# Altium project Led Cape.PrjPCB
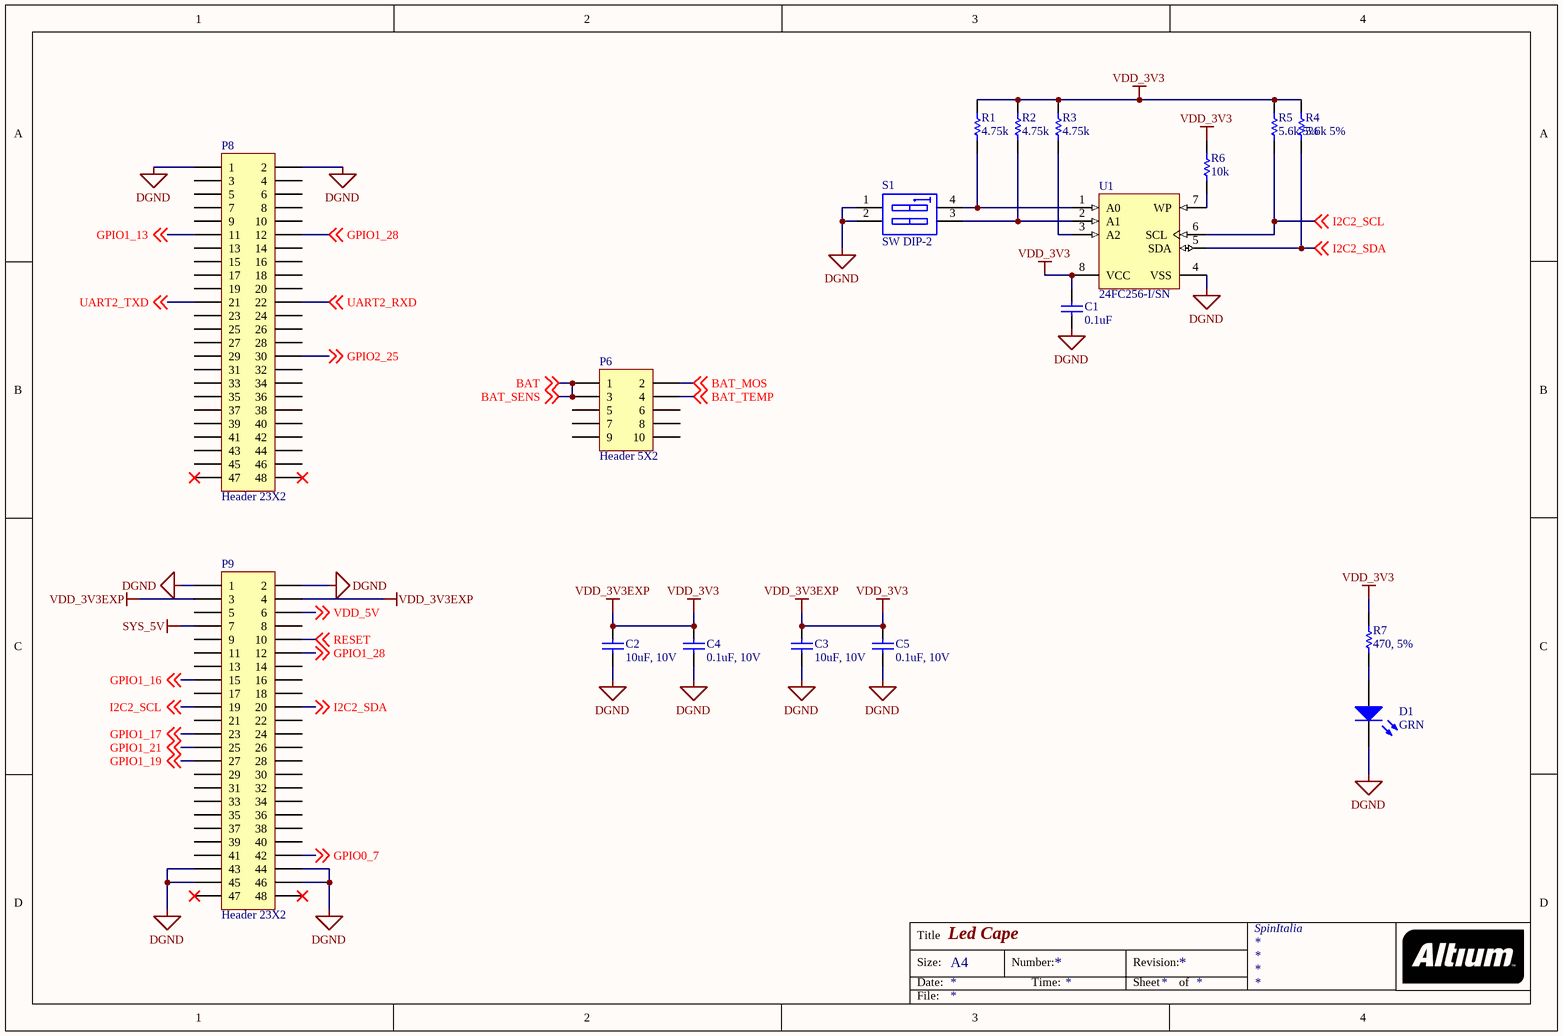
[diagram p0: Led Cape.SchDoc]
5 sheets, 52 parts. Net scope: global (net labels, ports and power ports of the same name join across sheets).
Sheets:
  Led Cape.SchDoc
  Beaglebone Led Cape.SchDoc
  battery cape.SchDoc
  Gps cape.SchDoc
  Relè Cape.SchDoc

## Sheet Led Cape.SchDoc: Led Cape
size A4; Author: Luca Lucci; CompanyName: SpinItalia; Engineer: Luca Lucci; Organization: SpinItalia; ProjectName: Led Cape

### Parts
(Parts that share a designator on the sheet are numbered #1, #2 ... from top to bottom, then left to right.)
C1  0.1uF  [1608[0603]]
C2  10uF, 10V  [1608[0603]]
C3  10uF, 10V  [1608[0603]]
C4  0.1uF, 10V  [1608[0603]]
C5  0.1uF, 10V  [1608[0603]]
D1#1  GRN  [3.5X2.8X1.9]
P6  Header 5X2  [HDR2X5]
P8  Header 23X2  [HDR2X24]
P9  Header 23X2  [HDR2X24]
R1  4.75k  [6-0805_N]
R2  4.75k  [6-0805_N]
R3  4.75k  [6-0805_N]
R4  5.6k 5%  [6-0805_N]
R5  5.6k 5%  [6-0805_N]
R6  10k  [6-0805_N]
R7  470, 5%  [6-0805_N]
S1  SW DIP-2  [DIP-4]
U1#1  24FC256-I/SN  [SOIC-SN8_N]

### Nets
DGND: C1.1 C2.1 C3.1 C4.1 C5.1 D1#1.2(K) P8.1 P8.2 P9.1 P9.2 P9.43 P9.44 P9.45 P9.46 S1.1(A1) S1.2(A2) U1#1.4(VSS)
SYS_5V: P9.7
VDD_3V3: C1.2 C2.2 C3.2 C4.2 C5.2 P9.3 P9.4 R1.1 R2.1 R3.1 R4.2 R5.2 R6.2 R7.2 U1#1.8(VCC)  [also labelled VDD_3V3EXP]
BAT: P6.1 P6.3 ; off-sheet BAT_SENS, off-sheet BAT  [also labelled BAT_SENS]
BAT_MOS: P6.2 ; off-sheet BAT_MOS
BAT_TEMP: P6.4 ; off-sheet BAT_TEMP
GPIO0_7: P9.42 ; off-sheet GPIO0_7
GPIO1_13: P8.11 ; off-sheet GPIO1_13
GPIO1_16: P9.15 ; off-sheet GPIO1_16
GPIO1_17: P9.23 ; off-sheet GPIO1_17
GPIO1_19: P9.27 ; off-sheet GPIO1_19
GPIO1_21: P9.25 ; off-sheet GPIO1_21
GPIO1_28: P8.12 P9.12 ; off-sheet GPIO1_28
GPIO2_25: P8.30 ; off-sheet GPIO2_25
I2C2_SCL: P9.19 R5.1 U1#1.6(SCL) ; off-sheet I2C2_SCL
I2C2_SDA: P9.20 R4.1 U1#1.5(SDA) ; off-sheet I2C2_SDA
RESET: P9.10 ; off-sheet RESET
UART2_RXD: P8.22 ; off-sheet UART2_RXD
UART2_TXD: P8.21 ; off-sheet UART2_TXD
VDD_5V: P9.6 ; off-sheet VDD_5V
NetD1#1_1: D1#1.1(A) R7.1
NetR1_2: R1.2 S1.4(B1) U1#1.1(A0)
NetR2_2: R2.2 S1.3(B2) U1#1.2(A1)
NetR3_2: R3.2 U1#1.3(A2)
NetR6_1: R6.1 U1#1.7(WP)

Not connected (* = marked no-connect by the designer): P6 5 6 7 8 9 10; P8 3 4 5 6 7 8 9 10 13 14 15 16 17 18 19 20 23 24 25 26 27 28 29 31 32 33 34 35 36 37 38 39 40 41 42 43 44 45 46 47* 48*; P9 5 8 9 11 13 14 16 17 18 21 22 24 26 28 29 30 31 32 33 34 35 36 37 38 39 40 41 47* 48*

### Notes on the sheet
- Title
- Size:
- Date:
- A4
- Number:
- Time:
- Revision:
- Sheet
- of
- File:

### Library data of the parts
C1-C5 = Cap: Capacitor; Value: 100pF; Published: 8-Jun-2000; LatestRevisionDate: 17-Jul-2002; LatestRevisionNote: Re-released for DXP Platform.; PackageReference: RAD-0.3; Publisher: Altium Limited; PackageDescription: Radial Cap, Thru-Hole; 2 Leads; 0.3 in Pin Spacing
D1#1 = LED3: Typical BLUE SiC LED; Published: 8-Jun-2000; LatestRevisionDate: 17-Dec-2003; LatestRevisionNote: PCB Footprint replaced.; DatasheetVersion: 16-Apr-2002; PackageVersion: 16-Apr-2002; PackageReference: 3.5X2.8X1.9; Publisher: Altium Limited; PackageDescription: SM LED; 2 C-Bend Leads; Body 3.5 x 2.8 x 1.9 mm, inc leads (LxWxH typ)
P6 = Header 5X2: Header, 5-Pin, Dual row; LatestRevisionDate: 17-Jul-2002; LatestRevisionNote: Re-released for DXP Platform.; Publisher: Altium Limited
P8 P9 = Header 24X2: Header, 23-Pin, Dual row; LatestRevisionDate: 17-Jul-2002; LatestRevisionNote: Re-released for DXP Platform.; Publisher: Altium Limited
R1-R7 = Res1: Resistor; Value: 1K; Published: 8-Jun-2000; LatestRevisionDate: 17-Jul-2002; LatestRevisionNote: Re-released for DXP Platform.; PackageReference: AXIAL-0.3; Publisher: Altium Limited; PackageDescription: Axial Device, Thru-Hole; 2 Leads; 0.3 in Pin Spacing
S1 = SW DIP-2: DIP Switch, 2 Position, SPST; Published: 24-Mar-1999; LatestRevisionDate: 17-Jul-2002; LatestRevisionNote: Re-released for DXP Platform.; PackageReference: DIP-4; Publisher: Altium Limited
U1#1 = 24FC256-I/SN: 256Kbit, 1MHz, 2.5V, I2C Serial EEPROM, 8-Pin SOIC 150mil, Industrial Temperature; Published: 29-Jan-2009; DatasheetVersion: revP, Oct-2007; PackageVersion: revBB, Aug-2009; PackageReference: SOIC-SN8; Publisher: Altium Limited; PackageDescription: 8-Lead Plastic Small Outline (SN) - Narrow, 3.90mm Body [SOIC]; Supplier 1: Digi-Key; Supplier Part Number 1: 24FC256-I/SN-ND; Supplier 2: Farnell; Supplier Part Number 2: 1579572; Code_JEDEC: MS-012; Code_IPC: SOIC127P600-8; ComponentLink1Description: Datasheet; ComponentLink1URL: http://ww1.microchip.com/downloads/en/DeviceDoc/21203P.pdf; ComponentLink2Description: Packaging Specification; ComponentLink2URL: http://www.microchip.com/stellent/groups/techpub_sg/documents/packagingspec/en012702.pdf; ComponentLink3Description: Microchip.com Home; ComponentLink3URL: http://www.microchip.com/

## Sheet Beaglebone Led Cape.SchDoc
size A4
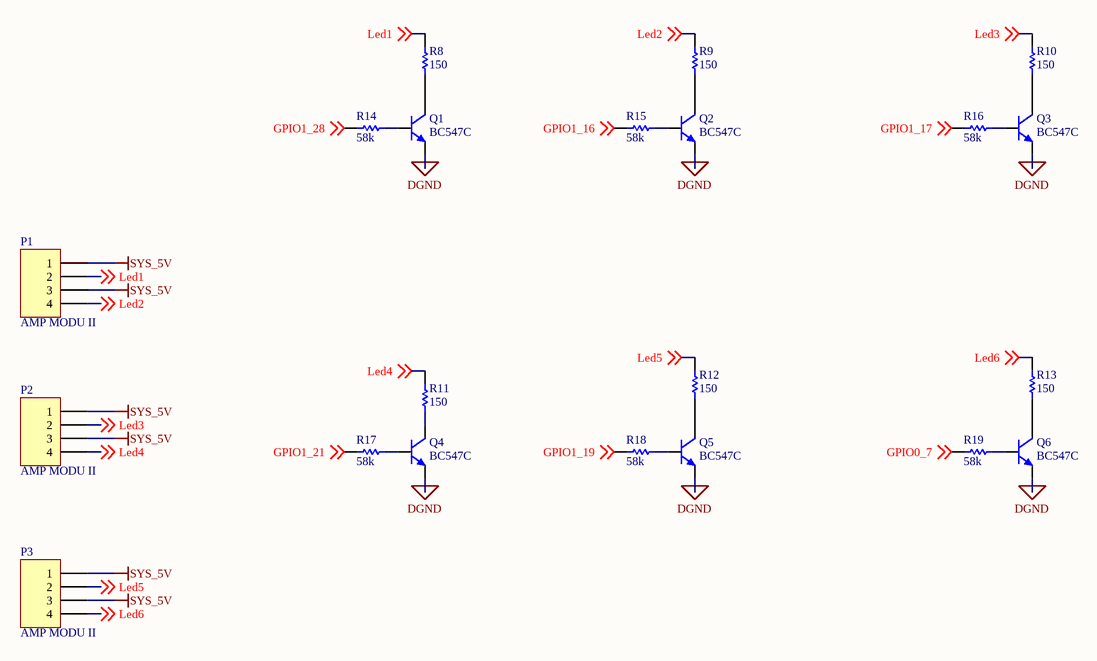
[diagram p1: Beaglebone Led Cape.SchDoc]

### Parts
(Parts that share a designator on the sheet are numbered #1, #2 ... from top to bottom, then left to right.)
P1  AMP MODU II  [MHDR1X4]
P2  AMP MODU II  [MHDR1X4]
P3  AMP MODU II  [MHDR1X4]
Q1  BC547C  [SOT-23B_N]
Q2  BC547C  [SOT-23B_N]
Q3  BC547C  [SOT-23B_N]
Q4  BC547C  [SOT-23B_N]
Q5  BC547C  [SOT-23B_N]
Q6#1  BC547C  [SOT-23B_N]
R8  150  [6-0805_N]
R9  150  [6-0805_N]
R10  150  [6-0805_N]
R11  150  [6-0805_N]
R12  150  [6-0805_N]
R13  150  [6-0805_N]
R14#1  58k  [6-0805_N]
R15#1  58k  [6-0805_N]
R16#1  58k  [6-0805_N]
R17  58k  [6-0805_N]
R18  58k  [6-0805_N]
R19  58k  [6-0805_N]

### Nets
DGND: Q1.3(E) Q2.3(E) Q3.3(E) Q4.3(E) Q5.3(E) Q6#1.3(E)
SYS_5V: P1.1 P1.3 P2.1 P2.3 P3.1 P3.3
GPIO0_7: R19.1 ; off-sheet GPIO0_7
GPIO1_16: R15#1.1 ; off-sheet GPIO1_16
GPIO1_17: R16#1.1 ; off-sheet GPIO1_17
GPIO1_19: R18.1 ; off-sheet GPIO1_19
GPIO1_21: R17.1 ; off-sheet GPIO1_21
GPIO1_28: R14#1.1 ; off-sheet GPIO1_28
Led1: P1.2 R8.2 ; off-sheet Led1
Led2: P1.4 R9.2 ; off-sheet Led2
Led3: P2.2 R10.2 ; off-sheet Led3
Led4: P2.4 R11.2 ; off-sheet Led4
Led5: P3.2 R12.2 ; off-sheet Led5
Led6: P3.4 R13.2 ; off-sheet Led6
NetQ1_1: Q1.1(C) R8.1
NetQ1_2: Q1.2(B) R14#1.2
NetQ2_1: Q2.1(C) R9.1
NetQ2_2: Q2.2(B) R15#1.2
NetQ3_1: Q3.1(C) R10.1
NetQ3_2: Q3.2(B) R16#1.2
NetQ4_1: Q4.1(C) R11.1
NetQ4_2: Q4.2(B) R17.2
NetQ5_1: Q5.1(C) R12.1
NetQ5_2: Q5.2(B) R18.2
NetQ6#1_1: Q6#1.1(C) R13.1
NetQ6#1_2: Q6#1.2(B) R19.2

### Library data of the parts
P1-P3 = MHDR1X4: Header, 4-Pin; LatestRevisionDate: 17-Jul-2002; LatestRevisionNote: Re-released for DXP Platform.; Publisher: Altium Limited
Q1-Q5 Q6#1 = QNPN: NPN Bipolar Transistor; Published: 8-Jun-2000; LatestRevisionDate: 29-May-2009; LatestRevisionNote: IPC-7351 Footprint Added.; PackageVersion: Aug-1999; PackageReference: SOT-23B; Publisher: Altium Limited; PackageDescription: 3-Pin SOT-23 Package 0.95 mm Pitch, 2.4 mm Lead Span
R8-R13 R14#1 R15#1 R16#1 R17-R19 = Res1: Resistor; Value: 1K; Published: 8-Jun-2000; LatestRevisionDate: 17-Jul-2002; LatestRevisionNote: Re-released for DXP Platform.; PackageReference: AXIAL-0.3; Publisher: Altium Limited; PackageDescription: Axial Device, Thru-Hole; 2 Leads; 0.3 in Pin Spacing

## Sheet battery cape.SchDoc
size A4
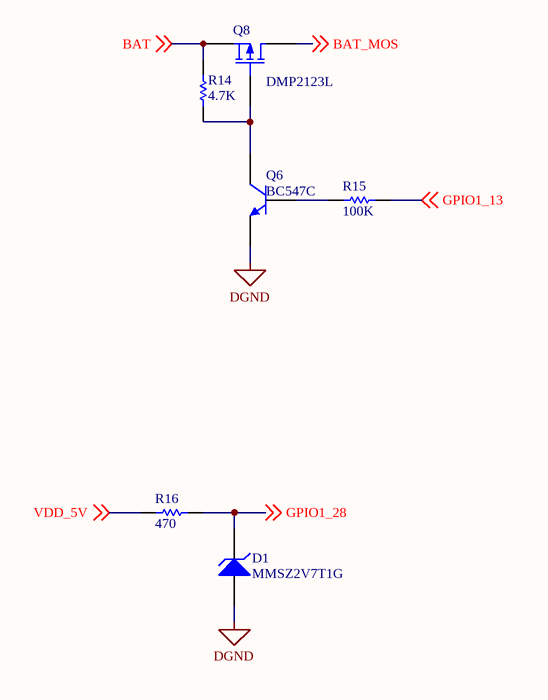
[diagram p2: battery cape.SchDoc]

### Parts
(Parts that share a designator on the sheet are numbered #1, #2 ... from top to bottom, then left to right.)
D1#2  MMSZ2V7T1G  [DIODE-0.7]
Q6#2  BC547C  [SOT-23B_N]
Q8  DMP2123L  [E3]
R14#2  4.7K  [AXIAL-0.3]
R15#2  100K  [AXIAL-0.3]
R16#2  470  [AXIAL-0.3]

### Nets
DGND: D1#2.1(A) Q6#2.3(E)
BAT: Q8.3(S) R14#2.2 ; off-sheet BAT
BAT_MOS: Q8.1(D) ; off-sheet BAT_MOS
GPIO1_13: R15#2.2 ; off-sheet GPIO1_13
GPIO1_28: D1#2.2(K) R16#2.2 ; off-sheet GPIO1_28
VDD_5V: R16#2.1 ; off-sheet VDD_5V
NetQ6#2_1: Q6#2.1(C) Q8.2(G) R14#2.1
NetQ6#2_2: Q6#2.2(B) R15#2.1

### Library data of the parts
D1#2 = D Zener: Zener Diode; Published: 8-Jun-2000; LatestRevisionDate: 17-Jul-2002; LatestRevisionNote: Re-released for DXP Platform.; PackageReference: DIODE-0.7; Publisher: Altium Limited; PackageDescription: Diode, Thru-Hole; 2 Leads; 0.7 in Pin Spacing
Q6#2 = QNPN: NPN Bipolar Transistor; Published: 8-Jun-2000; LatestRevisionDate: 29-May-2009; LatestRevisionNote: IPC-7351 Footprint Added.; PackageVersion: Aug-1999; PackageReference: SOT-23B; Publisher: Altium Limited; PackageDescription: 3-Pin SOT-23 Package 0.95 mm Pitch, 2.4 mm Lead Span
Q8 = MOSFET-P: P-Channel MOSFET; Published: 8-Jun-2000; LatestRevisionDate: 17-Jul-2002; LatestRevisionNote: Re-released for DXP Platform.; PackageVersion: 1995/1996; PackageReference: E3; Publisher: Altium Limited; PackageDescription: TO, Flat Index; 3 In-Line, Axial Leads; Body Dia. 4.6mm; Lead Dia. 0.5 mm (max)
R14#2 = Res1: Value: 1K; Published: 8-Jun-2000; LatestRevisionDate: 17-Jul-2002; LatestRevisionNote: Re-released for DXP Platform.; PackageReference: AXIAL-0.3; Publisher: Altium Limited; PackageDescription: Axial Device, Thru-Hole; 2 Leads; 0.3 in Pin Spacing
R15#2 R16#2 = Res1: Resistor; Value: 1K; Published: 8-Jun-2000; LatestRevisionDate: 17-Jul-2002; LatestRevisionNote: Re-released for DXP Platform.; PackageReference: AXIAL-0.3; Publisher: Altium Limited; PackageDescription: Axial Device, Thru-Hole; 2 Leads; 0.3 in Pin Spacing

## Sheet Gps cape.SchDoc
size A4
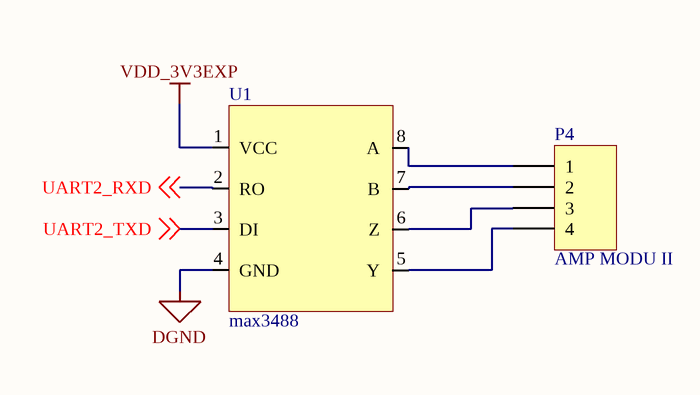
[diagram p3: Gps cape.SchDoc]

### Parts
(Parts that share a designator on the sheet are numbered #1, #2 ... from top to bottom, then left to right.)
P4  AMP MODU II  [MHDR1X4]
U1#2  max3488  [DIP-8]

### Nets
DGND: U1#2.4(GND)
VDD_3V3EXP: U1#2.1(VCC)  [project net VDD_3V3]
UART2_RXD: U1#2.2(RO) ; off-sheet UART2_RXD
UART2_TXD: U1#2.3(DI) ; off-sheet UART2_TXD
NetP4_1: P4.1 U1#2.8(A)
NetP4_2: P4.2 U1#2.7(B)
NetP4_3: P4.3 U1#2.6(Z)
NetP4_4: P4.4 U1#2.5(Y)

### Library data of the parts
P4 = MHDR1X4: Header, 4-Pin; LatestRevisionDate: 17-Jul-2002; LatestRevisionNote: Re-released for DXP Platform.; Publisher: Altium Limited
U1#2 = max3488: 3.3 V powered RS-485/RS-422 Transceiver

## Sheet Relè Cape.SchDoc
size A4
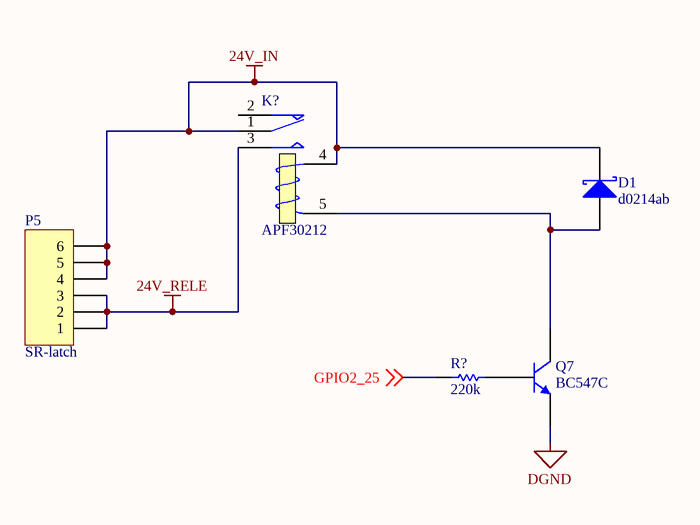
[diagram p4: Relè Cape.SchDoc]

### Parts
(Parts that share a designator on the sheet are numbered #1, #2 ... from top to bottom, then left to right.)
D1#3  d0214ab  [SMB]
K?  APF30212  [MODULE5B]
P5  SR-latch  [HDR1X6]
Q7  BC547C  [SOT-23B_N]
R?  220k  [AXIAL-0.3]

### Nets
24V_IN: D1#3.2(K) K?.1(COM) K?.4(T1) P5.4 P5.5 P5.6
24V_RELE: K?.3(NO) P5.1 P5.2 P5.3
DGND: Q7.3(E)
GPIO2_25: R?.1 ; off-sheet GPIO2_25
NetD1#3_1: D1#3.1(A) K?.5(T2) Q7.1(C)
NetQ7_2: Q7.2(B) R?.2

Not connected (* = marked no-connect by the designer): K? 2(NC)

### Library data of the parts
D1#3 = D Schottky: Schottky Diode; Published: 8-Jun-2000; LatestRevisionDate: 17-Jul-2002; LatestRevisionNote: Re-released for DXP Platform.; PackageReference: SMB; Publisher: Altium Limited; PackageDescription: DO-214-AA/SMB; 2 C-Bend Leads; Body 5.3 x 3.6 mm, inc. leads (LxW); Code_JEDEC: DO-214-AA
K? = Relay: SPDT Relay; Published: 8-Jun-2000; LatestRevisionDate: 17-Jul-2002; LatestRevisionNote: Re-released for DXP Platform.; PackageReference: MODULE5B; Publisher: Altium Limited
P5 = Header 6: Header, 6-Pin; LatestRevisionDate: 17-Jul-2002; LatestRevisionNote: Re-released for DXP Platform.; Publisher: Altium Limited
Q7 = QNPN: NPN Bipolar Transistor; Published: 8-Jun-2000; LatestRevisionDate: 29-May-2009; LatestRevisionNote: IPC-7351 Footprint Added.; PackageVersion: Aug-1999; PackageReference: SOT-23B; Publisher: Altium Limited; PackageDescription: 3-Pin SOT-23 Package 0.95 mm Pitch, 2.4 mm Lead Span
R? = Res1: Resistor; Value: 1K; Published: 8-Jun-2000; LatestRevisionDate: 17-Jul-2002; LatestRevisionNote: Re-released for DXP Platform.; PackageReference: AXIAL-0.3; Publisher: Altium Limited; PackageDescription: Axial Device, Thru-Hole; 2 Leads; 0.3 in Pin Spacing

## Nets that join several sheets
DGND: Led Cape (17 pins), Beaglebone Led Cape (6 pins), battery cape (D1#2.1 Q6#2.3), Gps cape (U1#2.4), Relè Cape (Q7.3)
SYS_5V: Led Cape (P9.7), Beaglebone Led Cape (6 pins)
VDD_3V3: Led Cape (15 pins), Gps cape (U1#2.1)
BAT: Led Cape (P6.1 P6.3), battery cape (Q8.3 R14#2.2)
BAT_MOS: Led Cape (P6.2), battery cape (Q8.1)
GPIO0_7: Led Cape (P9.42), Beaglebone Led Cape (R19.1)
GPIO1_13: Led Cape (P8.11), battery cape (R15#2.2)
GPIO1_16: Led Cape (P9.15), Beaglebone Led Cape (R15#1.1)
GPIO1_17: Led Cape (P9.23), Beaglebone Led Cape (R16#1.1)
GPIO1_19: Led Cape (P9.27), Beaglebone Led Cape (R18.1)
GPIO1_21: Led Cape (P9.25), Beaglebone Led Cape (R17.1)
GPIO1_28: Led Cape (P8.12 P9.12), Beaglebone Led Cape (R14#1.1), battery cape (D1#2.2 R16#2.2)
GPIO2_25: Led Cape (P8.30), Relè Cape (R?.1)
UART2_RXD: Led Cape (P8.22), Gps cape (U1#2.2)
UART2_TXD: Led Cape (P8.21), Gps cape (U1#2.3)
VDD_5V: Led Cape (P9.6), battery cape (R16#2.1)